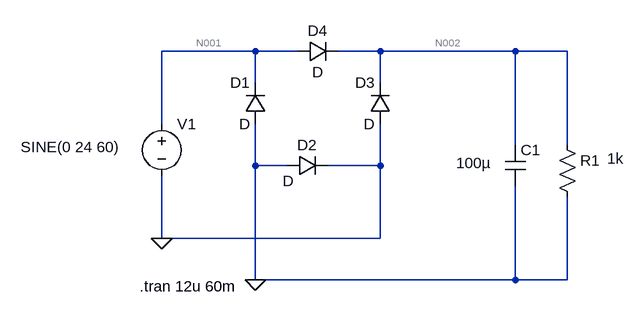
[diagram p0: schematic Conversor Tensao.asc]
Conversor Tensao.asc, the LTspice schematic file:
Version 4
SHEET 1 880 680
WIRE 144 16 0 16
WIRE 208 16 144 16
WIRE 336 16 272 16
WIRE 544 16 336 16
WIRE 624 16 544 16
WIRE 144 64 144 16
WIRE 336 64 336 16
WIRE 0 128 0 16
WIRE 544 160 544 16
WIRE 624 160 624 16
WIRE 144 192 144 128
WIRE 192 192 144 192
WIRE 336 192 336 128
WIRE 336 192 256 192
WIRE 0 304 0 208
WIRE 336 304 336 192
WIRE 336 304 0 304
WIRE 144 368 144 192
WIRE 544 368 544 224
WIRE 544 368 144 368
WIRE 624 368 624 240
WIRE 624 368 544 368
FLAG 0 304 0
FLAG 144 368 0
SYMBOL voltage 0 112 R0
WINDOW 3 -217 51 Left 2
WINDOW 123 0 0 Left 0
WINDOW 39 0 0 Left 0
SYMATTR InstName V1
SYMATTR Value SINE(0 24 60)
SYMBOL diode 160 128 R180
WINDOW 0 24 64 Left 2
WINDOW 3 24 0 Left 2
SYMATTR InstName D1
SYMBOL diode 192 208 R270
WINDOW 0 32 32 VTop 2
WINDOW 3 8 3 VBottom 2
SYMATTR InstName D2
SYMBOL diode 352 128 R180
WINDOW 0 24 64 Left 2
WINDOW 3 24 0 Left 2
SYMATTR InstName D3
SYMBOL diode 208 32 R270
WINDOW 0 32 32 VTop 2
WINDOW 3 0 32 VBottom 2
SYMATTR InstName D4
SYMBOL cap 528 160 R0
WINDOW 3 -75 28 Left 2
SYMATTR InstName C1
SYMATTR Value 100µ
SYMBOL res 608 144 R0
WINDOW 3 77 37 Left 2
SYMATTR InstName R1
SYMATTR Value 1k
TEXT -34 378 Left 2 !.tran 12u 60m

The netlist it stands for:
* Conversor Tensao.asc
V1 N001 0 SINE(0 24 60)
D1 0 N001 D
D2 0 0 D
D3 0 N002 D
D4 N001 N002 D
C1 N002 0 100µ
R1 N002 0 1k
.model D D
.lib standard.dio
.tran 12u 60m
.backanno
.end

* Results of the author's LTspice run, read from the files saved beside the schematic
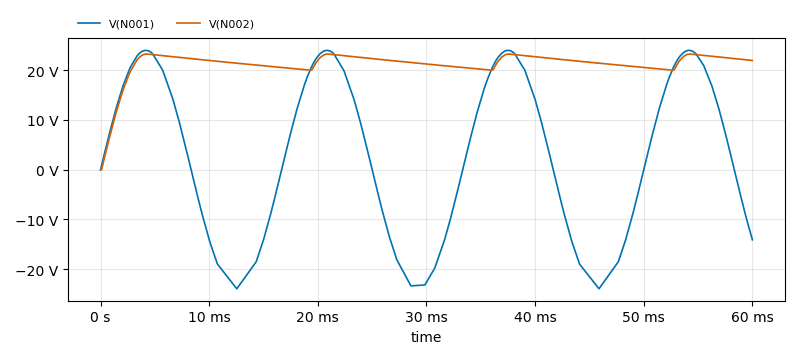
[diagram p1: Transient Analysis of Conversor Tensao.asc, plotted from the saved traces]
* Transient Analysis, 1 run:
*   V(N001): min -23.97 V, max 24 V, average 2.022 V, rms 16.66 V, last -14.11 V
*   V(N002): min 0 V, max 23.25 V, average 21.23 V, rms 21.43 V, last 21.97 V